# Altium project breather.PrjPcb
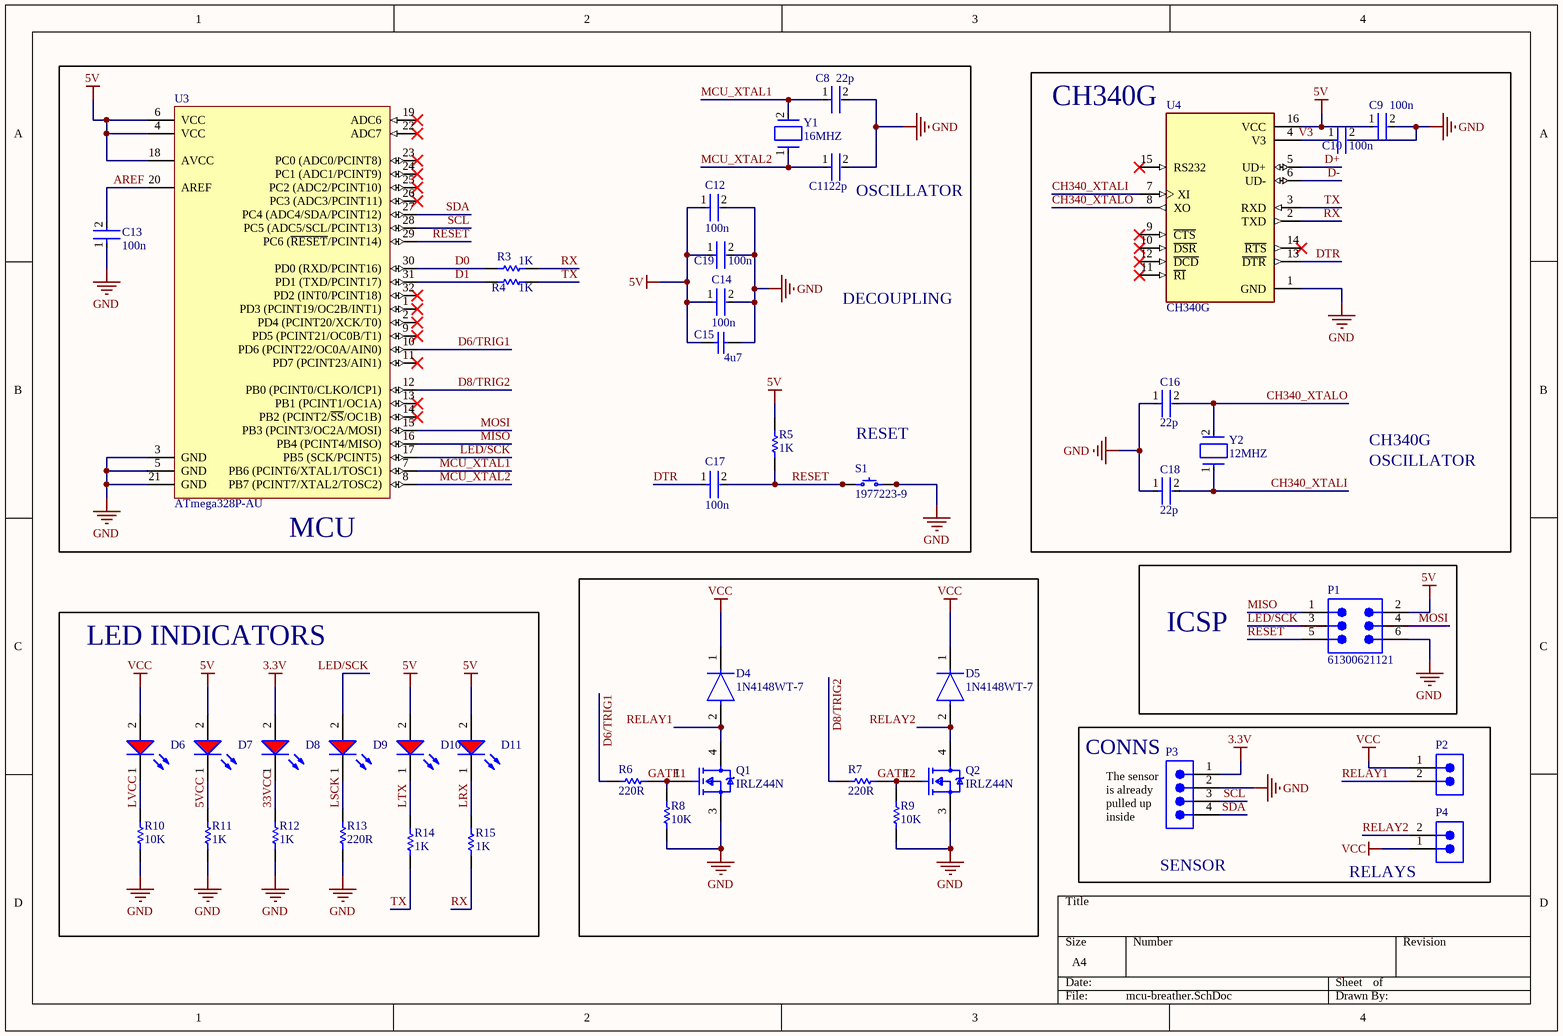
[diagram p0: mcu-breather.SchDoc]
2 sheets, 61 parts. Net scope: global (net labels, ports and power ports of the same name join across sheets).
Board file: breather-pcb.PcbDoc
Sheets:
  mcu-breather.SchDoc
  power-breather.SchDoc

## Sheet mcu-breather.SchDoc
size A4; SheetNumber: 2; SheetTotal: 2

### Parts
C8  22p  [FP-GRM188-0_1-e0_2_0_55-IPC_A]
C9  100n  [FP-GRM188-0_1-e0_2_0_55-IPC_A]
C10  100n  [FP-GRM188-0_1-e0_2_0_55-IPC_A]
C11  22p  [FP-GRM188-0_1-e0_2_0_55-IPC_A]
C12  100n  [FP-GRM188-0_1-e0_2_0_55-IPC_A]
C13  100n  [FP-GRM188-0_1-e0_2_0_55-IPC_A]
C14  100n  [FP-GRM188-0_1-e0_2_0_55-IPC_A]
C15  4u7  [CAPC2013X135X45NL10T25]
C16  22p  [FP-GRM188-0_1-e0_2_0_55-IPC_A]
C17  100n  [FP-GRM188-0_1-e0_2_0_55-IPC_A]
C18  22p  [FP-GRM188-0_1-e0_2_0_55-IPC_A]
C19  100n  [FP-GRM188-0_1-e0_2_0_55-IPC_A]
D4  1N4148WT-7  [FP-SOD523-MFG]
D5  1N4148WT-7  [FP-SOD523-MFG]
D6  150080RS75000  [WL-SMCW_0805_150080xx75000]  (value not drawn)
D7  150080RS75000  [WL-SMCW_0805_150080xx75000]  (value not drawn)
D8  150080RS75000  [WL-SMCW_0805_150080xx75000]  (value not drawn)
D9  150080RS75000  [WL-SMCW_0805_150080xx75000]  (value not drawn)
D10  150080RS75000  [WL-SMCW_0805_150080xx75000]  (value not drawn)
D11  150080RS75000  [WL-SMCW_0805_150080xx75000]  (value not drawn)
P1  61300621121  [61300621121]
P2  691311500002  [691311500002]  (value not drawn)
P3  691311500104  [691311500104]  (value not drawn)
P4  691311500002  [691311500002]  (value not drawn)
Q1  IRLZ44N  [FP-PG-TO263-3-MFG]
Q2  IRLZ44N  [FP-PG-TO263-3-MFG]
R3  1K  [RESC2013X60X35ML10T20]
R4  1K  [RESC2013X60X35ML10T20]
R5  1K  [RESC2013X60X35ML10T20]
R6  220R  [RESC2013X60X35ML10T20]
R7  220R  [RESC2013X60X35ML10T20]
R8  10K  [RESC2013X60X35ML10T20]
R9  10K  [RESC2013X60X35ML10T20]
R10  10K  [RESC2013X60X35ML10T20]
R11  1K  [RESC2013X60X35ML10T20]
R12  1K  [RESC2013X60X35ML10T20]
R13  220R  [RESC2013X60X35ML10T20]
R14  1K  [RESC2013X60X35ML10T20]
R15  1K  [RESC2013X60X35ML10T20]
S1  1977223-9  [TE FSM4JSMA]
U3  ATmega328P-AU  [32A_M]
U4  CH340G  [SOIC127P600X180-16N]
Y1  16MHZ  [FP-ABM7-MFG]
Y2  12MHZ  [FP-ABM7-MFG]

### Blocks framed on the sheet
MCU: C8 C11-C15 C17 C19 R3-R5 S1 U3 Y1
CH340G: C9 C10 C16 C18 U4 Y2
ICSP: P1
LED INDICATORS: D6-D11 R10-R15
CONNS: P2-P4

### Nets
3.3V: D8.2(A) P3.1
5V: C9.1 C12.1 C14.1 C15.1 C19.1 D7.2(A) D10.2(A) D11.2(A) P1.2 R5.2 U3.4(VCC) U3.6(VCC) U3.18(AVCC) U4.16(VCC)
GND: C8.2 C9.2 C10.2 C11.2 C12.2 C13.1 C14.2 C15.2 C16.1 C18.1 C19.2 P1.6 P3.2 Q1.3(S) Q2.3(S) R8.2 R9.2 R10.2 R11.1 R12.1 R13.2 S1.3 S1.4 U3.3(GND) U3.5(GND) U3.21(GND) U4.1(GND)
VCC: D4.1(C) D5.1(C) D6.2(A) P2.1 P4.1
5VCC: D7.1(K) R11.2
33VCC: D8.1(K) R12.2
AREF: C13.2 U3.20(AREF)
CH340_XTALI: C18.2 U4.7(XI) Y2.1
CH340_XTALO: C16.2 U4.8(XO) Y2.2
D0: R3.1 U3.30(PD0_(RXD/PCINT16))
D1: R4.1 U3.31(PD1_(TXD/PCINT17))
D6/TRIG1: R6.2 U3.10(PD6_(PCINT22/OC0A/AIN0))
D8/TRIG2: R7.2 U3.12(PB0_(PCINT0/CLKO/ICP1))
D+: U4.5(UD+)
D-: U4.6(UD-)
DTR: C17.1 U4.13(~{DTR})
LED/SCK: D9.2(A) P1.3 U3.17(PB5_(SCK/PCINT5))
LRX: D11.1(K) R15.2
LSCK: D9.1(K) R13.1
LTX: D10.1(K) R14.2
LVCC: D6.1(K) R10.1
MCU_XTAL1: C8.1 U3.7(PB6_(PCINT6/XTAL1/TOSC1)) Y1.2
MCU_XTAL2: C11.1 U3.8(PB7_(PCINT7/XTAL2/TOSC2)) Y1.1
MISO: P1.1 U3.16(PB4_(PCINT4/MISO))
MOSI: P1.4 U3.15(PB3_(PCINT3/OC2A/MOSI))
RELAY1: D4.2(A) P2.2 Q1.4(D)
RELAY2: D5.2(A) P4.2 Q2.4(D)
RESET: C17.2 P1.5 R5.1 S1.1 S1.2 U3.29(PC6_(~{RESET}/PCINT14))
RX: R3.2 R15.1 U4.2(TXD)
SCL: P3.3 U3.28(PC5_(ADC5/SCL/PCINT13))
SDA: P3.4 U3.27(PC4_(ADC4/SDA/PCINT12))
TX: R4.2 R14.1 U4.3(RXD)
V3: C10.1 U4.4(V3)
NetQ1_1: Q1.1(G) R6.1 R8.1
NetQ2_1: Q2.1(G) R7.1 R9.1

Not connected (* = marked no-connect by the designer): U3 1(PD3_(PCINT19/OC2B/INT1))* 2(PD4_(PCINT20/XCK/T0))* 9(PD5_(PCINT21/OC0B/T1))* 11(PD7_(PCINT23/AIN1))* 13(PB1_(PCINT1/OC1A))* 14(PB2_(PCINT2/~{SS}/OC1B))* 19(ADC6)* 22(ADC7)* 23(PC0_(ADC0/PCINT8))* 24(PC1_(ADC1/PCINT9))* 25(PC2_(ADC2/PCINT10))* 26(PC3_(ADC3/PCINT11))* 32(PD2_(INT0/PCINT18))*; U4 9(~{CTS})* 10(~{DSR})* 11(~{RI})* 12(~{DCD})* 14(~{RTS})* 15(RS232)*

### Notes on the sheet
- (near C11) OSCILLATOR
- DECOUPLING
- (near S1) RESET
- CH340G
- OSCILLATOR
- (near P3) The sensor is already pulled up inside
- (near P3) SENSOR
- (near P4) RELAYS
- Labels drawn without touching a wire or pin: GATE1, GATE2

### Library data of the parts
C8-C14 C16-C19 = CMP-2006-02792-2: Chip Multilayer Ceramic Capacitors for General Purpose, 0603, 10uF, X5R, 15%, 20%, 6.3V; Packaging: Tape and Reel; Voltage Rating (DC): 6.3V; Width: 0.031inch; Termination: SMD/SMT; Dielectric: X5R; Package Quantity: 4000; Voltage Rating: 6.3V; Capacitance: 10uF; Case/Package: 0603; Min Operating Temperature: -55°C; Voltage: 6.3V; Length: 1.6mm; Thickness: 0.035inch; Lead Free: Lead Free; Depth: 0.8mm; Case Code (Imperial): 0603; Max Operating Temperature: 85°C; Material: Ceramic; Height: 0.8mm; Tolerance: 20%; Mount: Surface Mount; REACH SVHC: No SVHC; Radiation Hardening: No; Case Code (Metric): 1608
C15 = CMP-2007-03607-1: Manufacturer: Murata; Part Number: GRM21BR72E103KW03L
D4 D5 = CMP-2000-05518-3: DIODE GEN PURP 80V 125MA SOD523; Power Rating: 150mW; Peak Non-Repetitive Surge Current: 2A; Forward Voltage: 1.25V; Reverse Recovery Time: 4ns; Peak Reverse Current: 1uA; Max Repetitive Reverse Voltage (Vrrm): 100V; Capacitance: 2pF; Polarity: Standard; Element Configuration: Single; Forward Current: 250mA; Lead Free: Lead Free; Packaging: Tape and Reel; Length: 0.9mm; Min Operating Temperature: -65°C; Current Rating: 125mA; Max Reverse Voltage (DC): 80V; Width: 1.3mm; Package Quantity: 3000; Output Current: 125mA; Power Dissipation: 150mW; Max Operating Temperature: 150°C; Radiation Hardening: No; Average Rectified Current: 125mA; Height: 0.65mm; Voltage Rating (DC): 80V; Max Surge Current: 2A; Weight: 3.5E-05oz; Recovery Time: 4ns; Max Forward Surge Current (Ifsm): 2A; Contact Plating: Tin; Number of Pins: 2; Mount: Surface Mount; REACH SVHC: No SVHC
D6-D11 = CMP-1426-00011-2: NexarPartId: 29717781; Peak Wavelength: 630nm; Wavelength: 625nm; Viewing Angle: 140°; Test Current: 20mA; Forward Voltage: 2V; Forward Current: 100mA; Lens Style: Clear, Rectangular; Color: Red; Luminous Intensity: 150mcd; Max Reverse Voltage (DC): 5V; Length: 2mm; Case Code (Imperial): 0805; RoHS: Compliant; Max Operating Temperature: 85°C; Height: 700µm; Packaging: Tape and Reel; Case/Package: 0805; REACH SVHC: Unknown; Dominant Wavelength: 625nm; Min Operating Temperature: -40°C; Case Code (Metric): 2012; Mount: Surface Mount; Width: 1.25mm
P1 = CMP-1502-01072-2: NexarPartId: 32855529; Current Rating: 3A; Number of Positions: 6; Connector Type: Male Pin; Voltage Rating: 250V; Gender: Male; Row Spacing: 2.54mm; Contact Resistance: 20mΩ; Contact Plating: Gold; Packaging: Bulk; Number of Contacts: 6; Contact Material: Copper; Operating Supply Voltage: 250V; Number of Rows: 2; Orientation: Vertical; Height: 8.89mm; RoHS: Compliant; Min Operating Temperature: -40°C; Max Operating Temperature: 105°C; Pitch: 2.54mm; Lead Pitch: 2.54mm; Number of Pins: 6; Color: Black; Mount: Through Hole; Termination: Solder; Contact Mating Length: 5.9944mm; REACH SVHC: Unknown
P2 P4 = CMP-1502-02123-2: NexarPartId: 8917741; Current: 20A; Number of Contacts: 2; Number of Levels: 1; Gender: Male; Pitch: 5.08mm; Voltage: 300V; Length: 8.5mm; Number of Pins: 2; Termination: Solder; Color: Green; Number of Rows: 1; Contact Plating: Tin; Number of Positions Per Level: 2; Orientation: Vertical; REACH SVHC: Unknown; Packaging: Box; Height: 12mm; Contact Material: Brass; Mount: Through Hole; Width: 10.16mm; RoHS: Compliant; Lead Pitch: 5.08mm
P3 = CMP-1502-02148-2: NexarPartId: 8917749; Pitch: 5.08mm; Number of Positions Per Level: 4; Gender: Male; Voltage: 300V; Current: 20A; Number of Levels: 1; Orientation: Vertical; Number of Pins: 4; Mount: Through Hole; Number of Contacts: 4; Length: 8.5mm; Number of Rows: 1; Contact Plating: Tin; Color: Green; Termination: Solder; Contact Material: Brass; REACH SVHC: Unknown; RoHS: Compliant; Lead Pitch: 5.08mm; Width: 22.32mm; Height: 12mm; Packaging: Box
Q1 Q2 = CMP-32901-000495-1: MOSFET N-CH 55V 47A D2PAK - IRLZ44NSTRLPBF; Rds On Max: 22mR; Input Capacitance: 1.7nF; Turn-On Delay Time: 11ns; Turn-Off Delay Time: 26ns; Power Dissipation: 110W; Element Configuration: Single; Gate to Source Voltage (Vgs): 16V; Drain to Source Resistance: 35mR; Threshold Voltage: 2V; Max Power Dissipation: 3.8W; Lead Free: Contains Lead; Max Dual Supply Voltage: 55V; Width: 0.38inch; Mount: Surface Mount; Continuous Drain Current (ID): 47A; Min Operating Temperature: -55°C; Number of Pins: 3; REACH SVHC: No SVHC; Height: 0.19inch; Length: 0.42inch; Case/Package: D2PAK; Drain to Source Breakdown Voltage: 55V; Packaging: Tape and Reel; Drain to Source Voltage (Vdss): 55V; Halogen Free: Halogen Free; RoHS Compliant: Yes; Max Operating Temperature: 175°C
R3-R15 = CMP-2100-03671-1: Chip Resistor, 1 KOhm, +/- 1%, 125 mW, -55 to 155 degC, 0805 (2012 Metric), RoHS, Tape and Reel; Manufacturer: Yageo; Temperature Coefficient: 100ppm/degreesC; Voltage Rating (DC): 150V; Max Power Dissipation: 125mW; Resistance: 1KOhm; Number of Pins: 2; Number of Terminations: 2; Datasheet URL: http://www.yageo.com/NewPortal/yageodocoutput?fileName=/pdf/R-Chip/PYu-RC_Group_51_RoHS_L_5.pdf; Length: 0.079inch; Package Description: 2-Pin Surface Mounted Device, Body 2 x 1.25 mm; Depth: 1.25mm; Height: 0.024inch; Military Standard: Not; Case/Package: 0805; Package Reference: 0805; RoHSCompliant: true; Lead Free: LeadFree; Packaging: TapeandReel; Package Quantity: 1; Datasheet Version: Rev. 5, 10/2016; Tolerance: 1%; Min Operating Temperature: -55degC; Voltage Rating: 150V; Composition: ThickFilm; Case Code (Imperial): 0805; Power Rating: 125mW; Width: 0.049inch; Case Code (Metric): 2012; Manufacturer URL: http://www.yageo.com/; Max Operating Temperature: 155degC; REACH SVHC: Unknown; Termination: SMD/SMT
S1 = 1977223-9: SWITCH TACTILE SPST-NO 0.05A 24V; Manufacturer: TE Connectivity ALCOSWITCH Switches; Actuator Height off PCB, Vertical: 5.00mm; Actuator Orientation: Top Actuated; Actuator Type: Standard; Contact Rating @ Voltage: 0.05A @ 24VDC; Illumination: Non-Illuminated; Operating Force: 160gf; Outline: 6.00mm x 6.00mm; Switch Function: Off-Mom; Part Number: 1977223-9; Circuit: SPST-NO; ComponentLink1Description: Datasheet; ComponentLink1URL: https://www.te.com/commerce/DocumentDelivery/DDEController?Action=srchrtrv&DocNm=1308111-1_SWITCHES_CORE_PROGRAM_CATALOG&DocType=CS&DocLang=English; ComponentLink2Description: DigiKey Link; ComponentLink2URL: http://digikey.com/product-detail/en/te-connectivity-alcoswitch-switches/1977223-9/1977223-9-ND/5597033; LastUpdated: 8/30/2020 9:06:45 PM; Lifecycle Status: Active; Minimum Order: 30000; Mounting Type: Surface Mount; Packaging: Bulk; Price: 0.16; Series: FSMJSMA; Supplier 1: DigiKey; Supplier Part Number 1: 1977223-9-ND; Termination Style: Gull Wing
U3 = CMP-0095-00269-2: 8-bit AVR Microcontroller, 32KB Flash, 1KB EEPROM, 2KB SRAM, 32-pin TQFP, Industrial Grade (-40°C to 85°C); PackageDescription: 32-Lead, 7x7x1.0 mm Body, 0.8mm Lead Pitch, Thin Profile Plastic Quad Flat Package (TQFP); DatasheetVersion: revD, May-2011; RevisionNote: DatasheetVersion & PackageVersion updated. URLs added.; ComponentLink1URL: http://www.atmel.com/; ComponentLink2Description: ATmega48A/48PA/88A/88PA/168A/168PA/328/328P Datasheet; Code_JEDEC: MS-026-ABA; ComponentLink1Description: Manufacturer URL; PackageReference: 32A; ComponentLink3Description: ATmega48A/48PA/88A/88PA/168A/168PA/328/328P Summary; ComponentLink2URL: http://www.atmel.com/dyn/resources/prod_documents/doc8271.pdf; PackageVersion: revC, Oct-2010; ComponentLink3URL: http://www.atmel.com/dyn/resources/prod_documents/8271S.pdf
U4 = CH340G: USB Interface Integrated Circuit; MF: WCH; Value: *; SnapEDA_Link: https://www.snapeda.com/parts/Ch340G/WCH/view-part/?ref=snap; MP: Ch340G; Check_prices: https://www.snapeda.com/parts/Ch340G/WCH/view-part/?ref=eda; Availability: Not in stock; Price: None; Package: None
Y1 = CMP-27762-000095-1: Crystal 16MHz ±20ppm 18pF SMD-2 6mm x 3.5mm - ABM7-16.000MHZ-D2Y-T; ESR (Equivalent Series Resistance): 50R; Frequency Stability: 30ppm; Width: 3.3mm; Frequency: 16MHz; Radiation Hardening: No; Height: 0.055inch; Tolerance: 20ppm; Length: 6mm; Case/Package: CSMD; Lead Free: Lead Free; Min Operating Temperature: -40°C; Termination: SMD/SMT; Operating Frequency: 16 MHz; Resistor Type: Ceramic; Packaging: Tape and Reel; Mount: Surface Mount; Load Capacitance: 18pF; Frequency Tolerance: 20ppm; Depth: 3.5mm; Series: ABM7; Package Quantity: 1000; Max Operating Temperature: 85°C; Number of Pins: 2
Y2 = CMP-27762-010912-1: Crystal 12MHz ±20ppm 18pF SMD-2 6mm x 3.5mm - ABM7-12.000MHZ-D2Y-T; Frequency Stability: 30ppm; ESR (Equivalent Series Resistance): 60R; Length: 6mm; Lead Free: Lead Free; Operating Frequency: 12 MHz; Packaging: Tape and Reel; Mount: Surface Mount; Frequency Tolerance: 20ppm; Radiation Hardening: No; Depth: 3.5mm; Tolerance: 20ppm; Height: 0.055inch; Number of Pins: 2; Series: ABM7; Package Quantity: 1000; Frequency: 12MHz; Series Resistance: 60R; Min Operating Temperature: -40°C; Resistor Type: Ceramic; Width: 0.138inch; Case/Package: CSMD; Load Capacitance: 18pF; Max Operating Temperature: 85°C; Termination: SMD/SMT

## Sheet power-breather.SchDoc
size A4; SheetNumber: 1; SheetTotal: 1
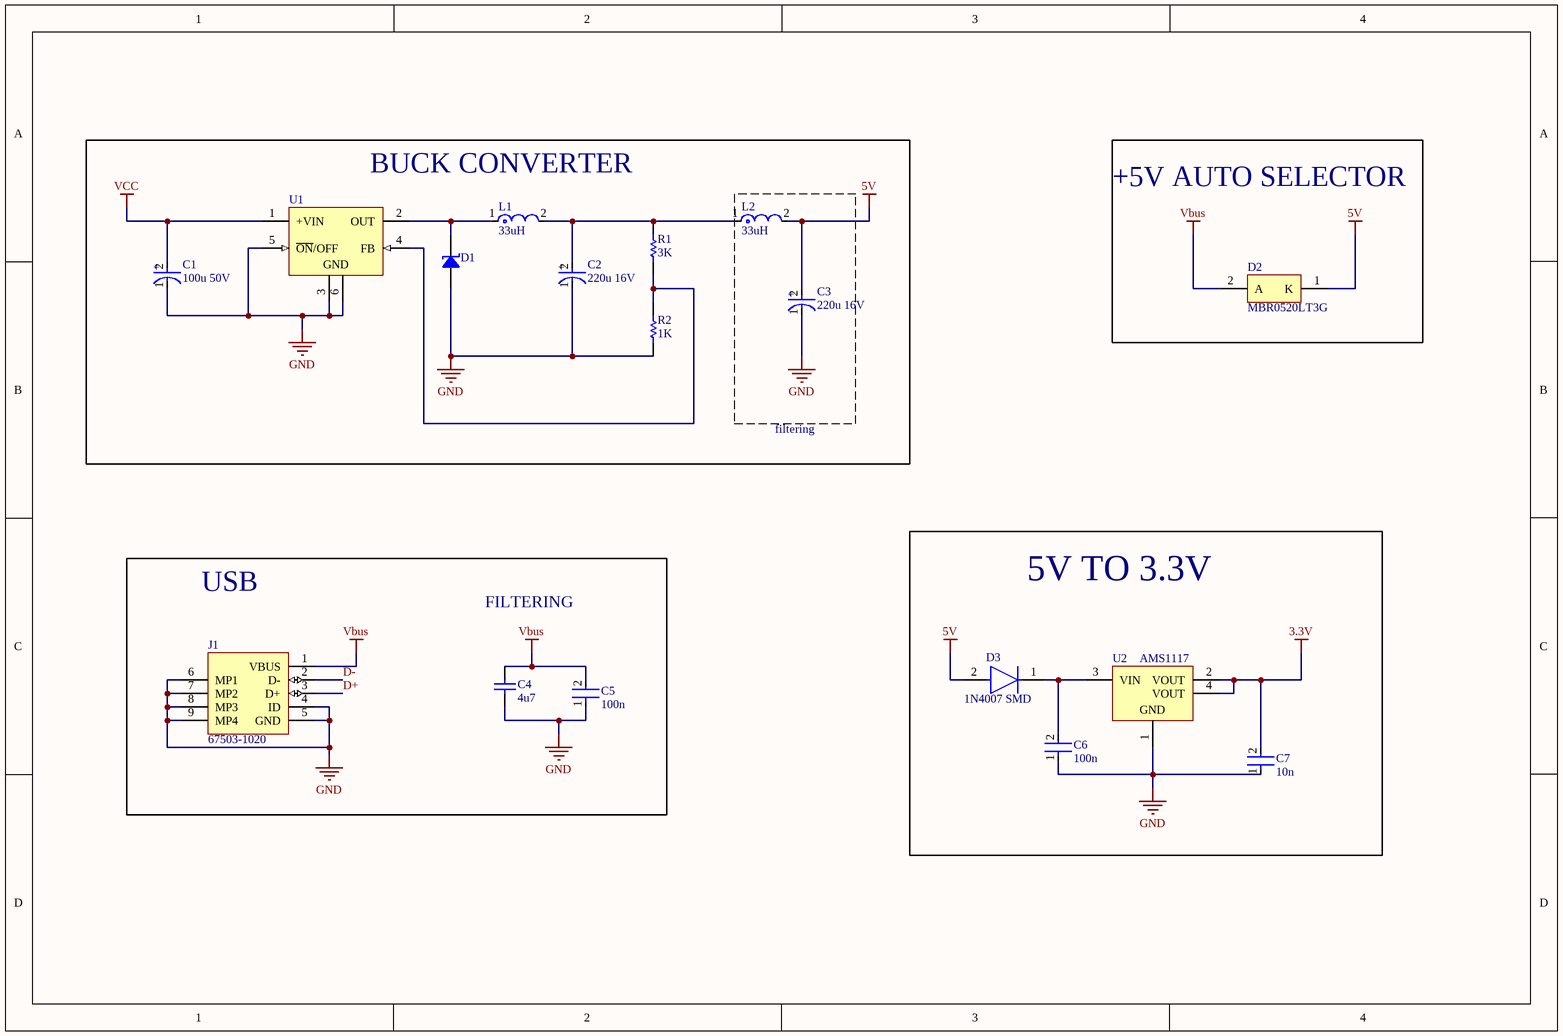
[diagram p1: power-breather.SchDoc]

### Parts
C1  100u 50V  [FP-UKA1H101MPD1TD-MFG]
C2  220u 16V  [FP-UKA1H101MPD1TD-MFG]
C3  220u 16V  [FP-UKA1H101MPD1TD-MFG]
C4  4u7  [CAPC2013X135X45NL10T25]
C5  100n  [FP-GRM188-0_1-e0_2_0_55-IPC_A]
C6  100n  [FP-GRM188-0_1-e0_2_0_55-IPC_A]
C7  10n  [FP-GRM188-0_1-e0_2_0_55-IPC_A]
D1  VTVS3V3GSMF-M3-08  [SMF DO-219AB]  (value not drawn)
D2  MBR0520LT3G  [ONSC-SOD-123-2-425-04_V]
D3  1N4007 SMD  [FP-1N4007_SMD-IPC_C]
J1  67503-1020  [MOLX-67503-1020_V]
L1  33uH  [FP-DEM10050C-MFG]
L2  33uH  [FP-DEM10050C-MFG]
R1  3K  [RESC2013X60X35ML10T20]
R2  1K  [RESC2013X60X35ML10T20]
U1  LM2596SX-ADJ/NOPB  [KTT0005B_L]  (value not drawn)
U2  AMS1117  [SOT-223_M]

### Blocks framed on the sheet
BUCK CONVERTER: C1-C3 D1 L1 L2 R1 R2 U1
+5V AUTO SELECTOR: D2
USB: C4 C5 J1
5V TO 3.3V: C6 C7 D3 U2

### Nets
3.3V: C7.2 U2.2(VOUT) U2.4(VOUT)
5V: C3.2(A) D2.1(K) D3.2(A) L2.2
GND: C1.1(C) C2.1(C) C3.1(C) C4.1 C5.1 C6.1 C7.1 D1.1 J1.4(ID) J1.5(GND) J1.6(MP1) J1.7(MP2) J1.8(MP3) J1.9(MP4) R2.1 U1.3(GND) U1.5(~{ON}/OFF) U1.6(GND) U2.1(GND)
Vbus: C4.2 C5.2 D2.2(A) J1.1(VBUS)
VCC: C1.2(A) U1.1(+VIN)
D+: J1.3(D+)
D-: J1.2(D-)
NetC2_2: C2.2(A) L1.2 L2.1 R1.2
NetC6_2: C6.2 D3.1(C) U2.3(VIN)
NetD1_2: D1.2 L1.1 U1.2(OUT)
NetR1_1: R1.1 R2.2 U1.4(FB)

### Notes on the sheet
- filtering
- FILTERING
- (in symbol CMP-12462-000027-1) +

### Library data of the parts
C1-C3 = CMP-12462-000027-1: CAP ALUM 100UF 20% 50V RADIAL; Life (Hours): 2000Hour; Ripple Current: 190mA; Leakage Current: 4uA; Termination: Radial; Mount: Through Hole; Length: 11.5mm; Series: KA; Case/Package: Radial; Package Quantity: 1; REACH SVHC: No SVHC; Height - Seated (Max): 0.512inch; Min Operating Temperature: -55°C; Packaging: Tape and Reel; Tolerance: 20%; Lead Pitch: 3.5mm; Voltage Rating (DC): 50V; Voltage Rating: 50V; Diameter: 8mm; Height: 11.5mm; Max Operating Temperature: 105°C; Capacitance: 100uF
C4 = CMP-2007-03607-1: as C15 on sheet mcu-breather
C5-C7 = CMP-2006-02792-2: as C8 on sheet mcu-breather; Packaging: Tape and Reel; Voltage Rating (DC): 6.3V; Width: 0.031inch; Termination: SMD/SMT; Dielectric: X5R; Package Quantity: 4000; Voltage Rating: 6.3V; Capacitance: 10uF; Case/Package: 0603; Min Operating Temperature: -55°C; Voltage: 6.3V; Length: 1.6mm; Thickness: 0.035inch; Lead Free: Lead Free; Depth: 0.8mm; Case Code (Imperial): 0603; Max Operating Temperature: 85°C; Material: Ceramic; Height: 0.8mm; Tolerance: 20%; Mount: Surface Mount; REACH SVHC: No SVHC; Radiation Hardening: No; Case Code (Metric): 1608
D1 = VTVS3V3GSMF-M3-08: ESD PROTECTION DIODE DO-219AB-M3; Manufacturer: Vishay Semiconductor Diodes Division; Capacitance @ Frequency: 2095pF @ 1MHz; Current - Peak Pulse (10/1000µs): 43.99A; Power Line Protection: No; Power - Peak Pulse: 400W; Type: Zener; Unidirectional Channels: 1; Voltage - Breakdown (Min): 6.57V; Voltage - Clamping (Max) @ Ipp: 8.9V; Voltage - Reverse Standoff (Typ): 3.3V; Part Number: VTVS3V3GSMF-M3-08; Applications: General Purpose; ComponentLink1Description: Datasheet; ComponentLink1URL: http://www.vishay.com/docs/85891/vtvs3v3asmf.pdf; ComponentLink2Description: DigiKey Link; ComponentLink2URL: http://digikey.com/product-detail/en/vishay-semiconductor-diodes-division/VTVS3V3GSMF-M3-08/VTVS3V3GSMF-M3-08GICT-ND/9467503; LastUpdated: 2/8/2024 9:51:14 PM; Lifecycle Status: Active; Minimum Order: 1; Mounting Type: Surface Mount; Operating Temperature: 175°C (TJ); Package / Case: DO-219AB; Packaging: TapeAndReel; PartId: 5497; Part Status: Active; Price: 0.21; Series: TransZorb®; Supplier 1: DigiKey; Supplier Part Number 1: VTVS3V3GSMF-M3-08GICT-ND; Supplier Device Package: DO-219AB (SMF)
D2 = CMP-1055-00408-1: Schottky Power Rectifier, 2-Pin SOD-123, Pb-Free, Tape and Reel; Manufacturer: On Semiconductor; Configuration: Single; IFSM Max (A): 5.5; PackageReference: SOD-123-2-425-04; ComponentLink3URL: http://www.onsemi.com/pub_link/Collateral/425-04.PDF; Mounting Technology: Surface Mount; PartNumber: MBR0520LT3G; ComponentLink1URL: http://www.onsemi.com/; ComponentLink1Description: Manufacturer URL; Packing: Tape and Reel; PackageDescription: 2-Pin SOD, Body 1.6 x 2.69 mm; ComponentLink2URL: http://www.onsemi.cn/pub_link/Collateral/MBR0520LT1-D.PDF; RoHS: TRUE; ComponentLink3Description: Package Specification; DatasheetVersion: Rev. 6; PackageVersion: Rev. G, 10/2009; ComponentLink2Description: Datasheet
D3 = CMP-12389-000001-1: Rectifier, 1Kv, 1A, Do-214Ac Rohs Compliant: Yes
J1 = CMP-0411-00002-1: USB, MINI, SMD, RA KME04-USBMU03A01; Manufacturer: Molex; ComponentLink1URL: http://www.molex.com/; PartNumber: 67503-1020; Mounting Technology: Surface Mount; ComponentLink1Description: Manufacturer URL; Terminal Pitch: 0.8 mm; DatasheetVersion: Rev F, 06/2009; ComponentLink2Description: Datasheet; PackageDescription: Mini USB Connector, SMT, Righer Angle; ComponentLink2URL: http://www.molex.com/pdm_docs/sd/675031020_sd.pdf; PackageReference: 67503-1020
L1 L2 = CMP-06042-015462-1: Shielded Wirewound Inductor 33uH 20% 2500mA 0.0936Ω SMD; Saturation Current: 3.5A; Core Material: Ferrite; Current Rating: 2.5A; Test Frequency: 100kHz; DC Resistance (DCR): 93.6mR; Inductance: 33uH; Mount: Surface Mount; Height - Seated (Max): 0.197inch; Length: 0.394inch; Shielding: Shielded; Resistor Type: Wirewound; Case/Package: SMD/SMT; Max DC Current: 2.5A; Width: 0.394inch; Number of Pins: 2; Tolerance: 20%; Packaging: Tape and Reel
R1 R2 = CMP-2100-03671-1: as R3 on sheet mcu-breather; Number of Pins: 2; Number of Terminations: 2; Datasheet URL: http://www.yageo.com/NewPortal/yageodocoutput?fileName=/pdf/R-Chip/PYu-RC_Group_51_RoHS_L_5.pdf; Length: 0.079inch; Package Description: 2-Pin Surface Mounted Device, Body 2 x 1.25 mm; Depth: 1.25mm; Height: 0.024inch; Military Standard: Not; Case/Package: 0805; Package Reference: 0805; RoHSCompliant: true; Lead Free: LeadFree; Packaging: TapeandReel; Package Quantity: 1; Datasheet Version: Rev. 5, 10/2016; Tolerance: 1%; Min Operating Temperature: -55degC; Voltage Rating: 150V; Composition: ThickFilm; Case Code (Imperial): 0805; Power Rating: 125mW; Width: 0.049inch; Case Code (Metric): 2012; Manufacturer URL: http://www.yageo.com/; Max Operating Temperature: 155degC; REACH SVHC: Unknown; Termination: SMD/SMT
U1 = CMP-2000-06545-1: Simple Switcher(R) Power Converter 150 kHz Step-Down Voltage Regulator, 3 A, 4.5 to 40 V, -40 to 125 degC, 5-Pin TO-263 (KTT), Green (RoHS & no Sb/Br), Tape and Reel; PartNumber: LM2596; Manufacturer: Texas Instruments; Package Version: 4200577-4/G, 01/2013; Primary Input Voltage: 40V; No. of Outputs: 1; No. of Pins: 5; SVHC: NoSVHC(19-Dec-2012); Output Voltage: 37V; Output Current: 3A; Datasheet Version: Rev. C, 04/2013; Package Reference: KTT5; MSL: MSL3-168hours; Number of Outputs: 1; Operating Temperature Min: -40°C; Operating Temperature Range: -40°Cto+125°C; Manufacturer URL: http://www.ti.com/; Package URL: http://www.ti.com/litv/pdf/mpsf007e; Voltage Regulator Case Style: TO-263; Operating Temperature Max: 125°C; Package Description: 5-Pin Plastic Flange Mount, Body 10.16 x 8.925 mm, Pitch 1.7 mm; Datasheet URL: http://www.ti.com/lit/ds/symlink/lm2596.pdf; Mounting Technology: SurfaceMount
U2 = CMP-0244-00316-1: 1A, Low Drop Positive Voltage Regulator, 3.3V, 4-Pin SOT-223, Tape and Reel; ComponentLink1Description: Manufacturer URL; DatasheetVersion: 2/12/2011; PackageVersion: 2010; ComponentLink1URL: http://www.st.com; ComponentLink2Description: Datasheet; ComponentLink2URL: http://www.st.com/internet/com/TECHNICAL_RESOURCES/TECHNICAL_LITERATURE/DATASHEET/CD00002116.pdf; PackageDescription: 4-Pin SOT-223 Package, 6.5 x 3.5 mm Body, 2.3 mm Pitch, 7 mm Lead Span; PackageReference: SOT-223

## Nets that join several sheets
3.3V: mcu-breather (D8.2 P3.1), power-breather (C7.2 U2.2 U2.4)
5V: mcu-breather (14 pins), power-breather (C3.2 D2.1 D3.2 L2.2)
GND: mcu-breather (27 pins), power-breather (19 pins)
VCC: mcu-breather (5 pins), power-breather (C1.2 U1.1)
D+: mcu-breather (U4.5), power-breather (J1.3)
D-: mcu-breather (U4.6), power-breather (J1.2)